# EAGLE design DACPSU (EAGLE 5.07)
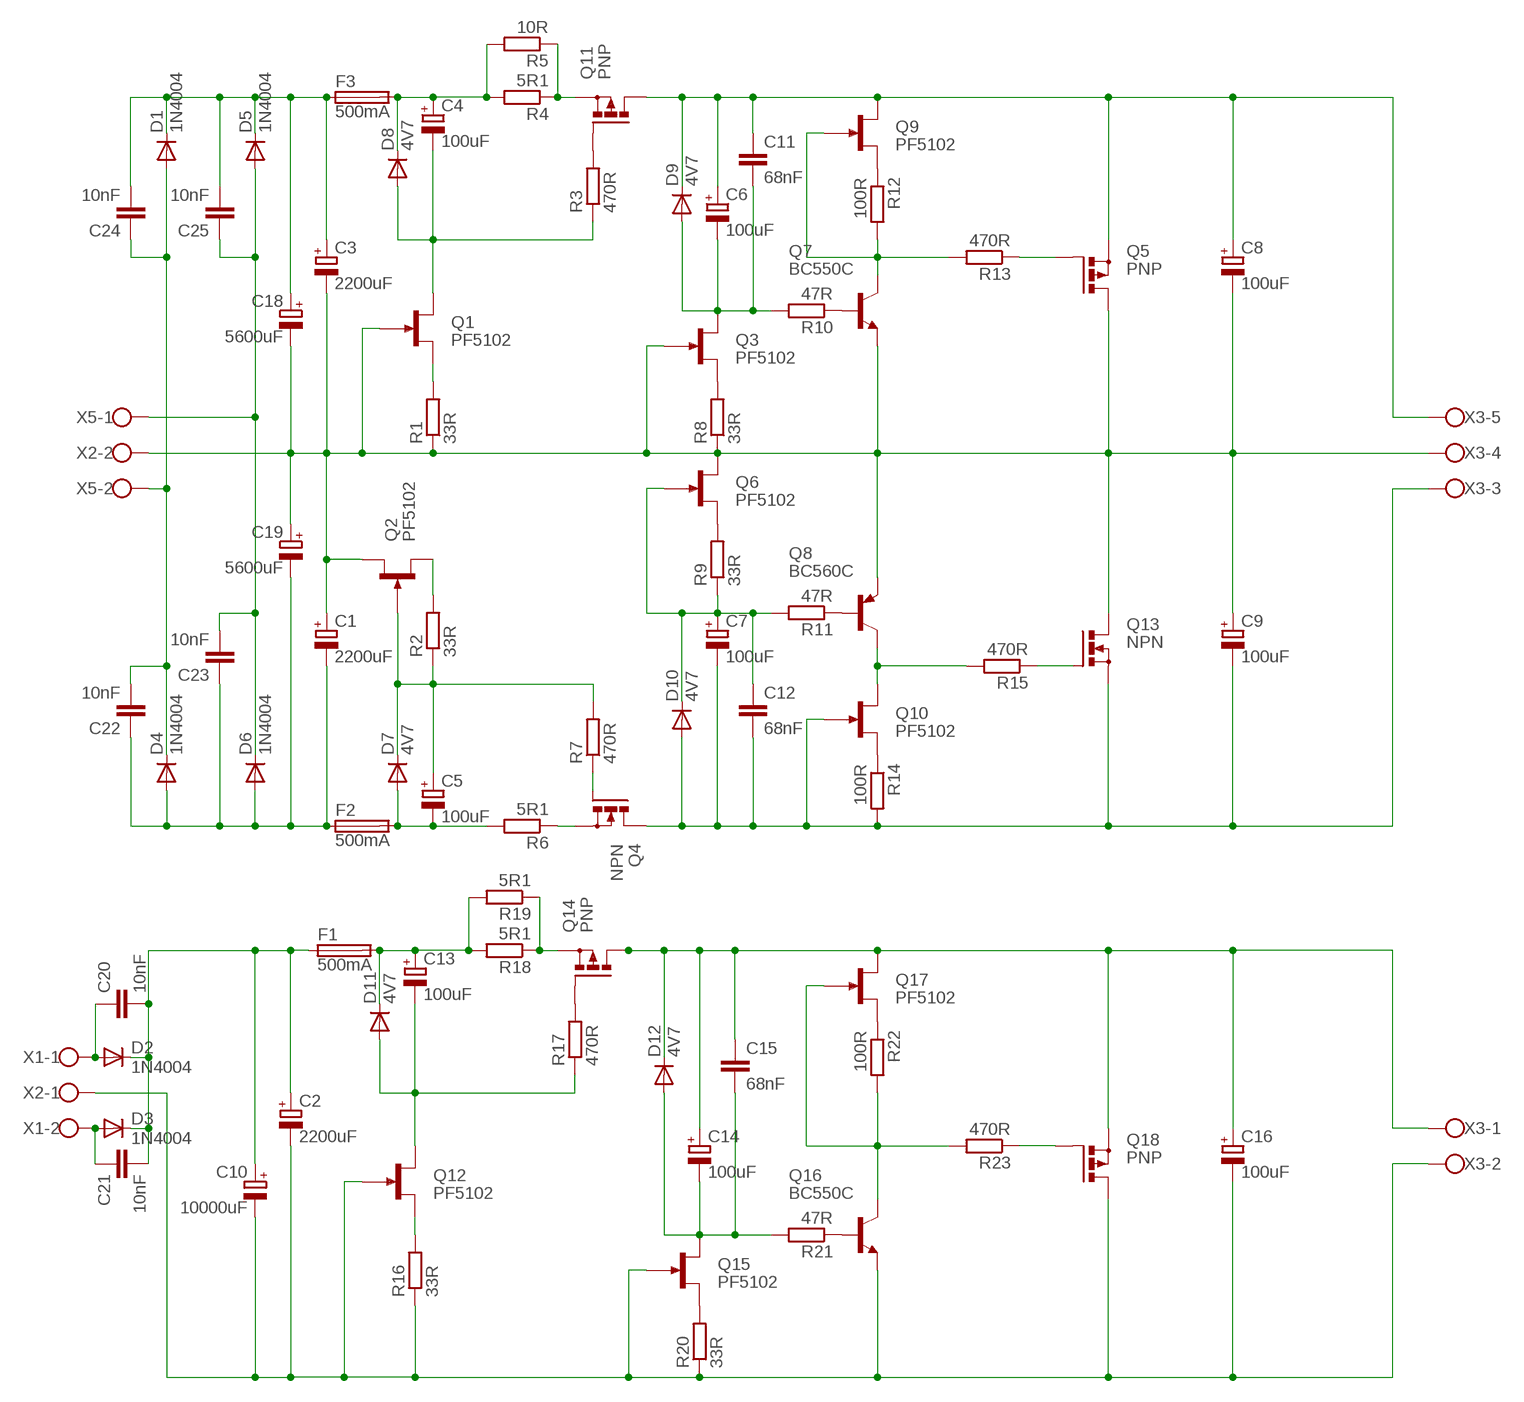
[diagram p0: schematic, sheet 1]

## Parts
C1  2200uF  CPOL-EUE7.5-18  [E7,5-18]
C2  2200uF  CPOL-EUE7.5-18  [E7,5-18]
C3  2200uF  CPOL-EUE7.5-18  [E7,5-18]
C4  100uF  CPOL-EUE3.5-8  [E3,5-8]
C5  100uF  CPOL-EUE3.5-8  [E3,5-8]
C6  100uF  CPOL-EUE3.5-8  [E3,5-8]
C7  100uF  CPOL-EUE3.5-8  [E3,5-8]
C8  100uF  CPOL-EUE7.5-18  [E7,5-18]
C9  100uF  CPOL-EUE7.5-18  [E7,5-18]
C10  10000uF  CPOL-EUE7.5-18  [E7,5-18]
C11  68nF  C-EU075-042X103  [C075-042X103]
C12  68nF  C-EU075-042X103  [C075-042X103]
C13  100uF  CPOL-EUE3.5-8  [E3,5-8]
C14  100uF  CPOL-EUE3.5-8  [E3,5-8]
C15  68nF  C-EU075-042X103  [C075-042X103]
C16  100uF  CPOL-EUE7.5-18  [E7,5-18]
C18  5600uF  CPOL-EUE7.5-18  [E7,5-18]
C19  5600uF  CPOL-EUE7.5-18  [E7,5-18]
C20  10nF  C-EU075-042X103  [C075-042X103]
C21  10nF  C-EU075-042X103  [C075-042X103]
C22  10nF  C-EU075-042X103  [C075-042X103]
C23  10nF  C-EU075-042X103  [C075-042X103]
C24  10nF  C-EU075-042X103  [C075-042X103]
C25  10nF  C-EU075-042X103  [C075-042X103]
D1  1N4004  [DO41-10]
D2  1N4004  [DO41-10]
D3  1N4004  [DO41-10]
D4  1N4004  [DO41-10]
D5  1N4004  [DO41-10]
D6  1N4004  [DO41-10]
D7  4V7  1N4004  [DO41-10]
D8  4V7  1N4004  [DO41-10]
D9  4V7  1N4004  [DO41-10]
D10  4V7  1N4004  [DO41-10]
D11  4V7  1N4004  [DO41-10]
D12  4V7  1N4004  [DO41-10]
F1  500mA  19560  [19560]
F2  500mA  19560  [19560]
F3  500mA  19560  [19560]
Q1  PF5102  2N5638  [TO92G]
Q2  PF5102  2N5638  [TO92G]
Q3  PF5102  2N5638  [TO92G]
Q4  NPN  PMOSFET_NTO220BH  [TO220BH]
Q5  PNP  PMOSFET_PTO220BH  [TO220BH]
Q6  PF5102  2N5638  [TO92G]
Q7  BC550C  BC550B  [TO92-EBC]
Q8  BC560C  BC560  [TO92-EBC]
Q9  PF5102  2N5638  [TO92G]
Q10  PF5102  2N5638  [TO92G]
Q11  PNP  PMOSFET_PTO220BH  [TO220BH]
Q12  PF5102  2N5638  [TO92G]
Q13  NPN  PMOSFET_NTO220BH  [TO220BH]
Q14  PNP  PMOSFET_PTO220BH  [TO220BH]
Q15  PF5102  2N5638  [TO92G]
Q16  BC550C  BC550B  [TO92-EBC]
Q17  PF5102  2N5638  [TO92G]
Q18  PNP  PMOSFET_PTO220BH  [TO220BH]
R1  33R  R-EU_0204/7  [0204/7]
R2  33R  R-EU_0204/7  [0204/7]
R3  470R  R-EU_0204/7  [0204/7]
R4  5R1  R-EU_0309/12  [0309/12]
R5  10R  R-EU_0309/12  [0309/12]
R6  5R1  R-EU_0309/12  [0309/12]
R7  470R  R-EU_0204/7  [0204/7]
R8  33R  R-EU_0204/7  [0204/7]
R9  33R  R-EU_0204/7  [0204/7]
R10  47R  R-EU_0204/7  [0204/7]
R11  47R  R-EU_0204/7  [0204/7]
R12  100R  R-EU_0204/7  [0204/7]
R13  470R  R-EU_0204/7  [0204/7]
R14  100R  R-EU_0204/7  [0204/7]
R15  470R  R-EU_0204/7  [0204/7]
R16  33R  R-EU_0204/7  [0204/7]
R17  470R  R-EU_0204/7  [0204/7]
R18  5R1  R-EU_0309/12  [0309/12]
R19  5R1  R-EU_0309/12  [0309/12]
R20  33R  R-EU_0204/7  [0204/7]
R21  47R  R-EU_0204/7  [0204/7]
R22  100R  R-EU_0204/7  [0204/7]
R23  470R  R-EU_0204/7  [0204/7]
X1  W237-02P  [W237-132]
X2  W237-02P  [W237-132]
X3  W237-05P  [W237-5P]
X5  W237-02P  [W237-132]

## Nets
N$1: C20.1 D2.A X1.1
N$2: C2.- C10.- C16.- Q12.G Q15.G Q16.E Q18.D R16.1 R20.1 X2.1 X3.2
N$3: C21.1 D3.A X1.2
N$4: Q15.S R20.2
N$5: Q16.B R21.1
N$6: C22.2 C24.1 D1.A D4.C X5.2
N$7: C23.2 C25.1 D5.A D6.C X5.1
N$8: C3.+ C18.+ C24.2 C25.2 D1.C D5.C F3.1
N$9: C4.+ D8.C F3.2 R4.2 R5.2
N$10: C5.- D7.A F2.2 R6.2
N$11: C4.- D8.A Q1.D R3.1
N$12: Q1.S R1.2
N$13: Q11.G R3.2
N$14: C5.+ D7.C Q2.G R2.1 R7.2
N$15: Q11.S R4.1 R5.1
N$16: Q2.S R2.2
N$17: Q4.G R7.1
N$18: Q4.S R6.1
N$19: C2.+ C10.+ C20.2 C21.2 D2.C D3.C F1.1
N$20: C7.- C9.- C12.2 D10.A Q4.D Q10.G Q13.S R14.2 X3.3
N$21: Q3.S R8.2
N$22: C6.- C11.2 D9.A Q3.D R10.2
N$23: Q6.S R9.2
N$24: C7.+ C12.1 D10.C Q6.G R9.1 R11.2
N$25: Q7.B R10.1
N$26: Q8.B R11.1
N$27: Q9.S R12.1
N$28: Q10.S R14.1
N$29: Q7.C Q9.G R12.2 R13.2
N$30: Q8.C Q10.D R15.2
N$31: Q5.G R13.1
N$32: Q13.G R15.1
N$33: C6.+ C8.+ C11.1 D9.C Q5.S Q9.D Q11.D X3.5
N$34: C13.- D11.A Q12.D R17.1
N$35: Q12.S R16.2
N$36: Q14.S R18.1 R19.1
N$37: Q14.G R17.2
N$38: C14.- C15.2 D12.A Q15.D R21.2
N$39: Q18.G R23.1
N$40: Q17.S R22.1
N$41: Q16.C Q17.G R22.2 R23.2
N$42: C14.+ C15.1 C16.+ D12.C Q14.D Q17.D Q18.S X3.1
N$43: C1.- C19.- C22.1 C23.1 D4.A D6.A F2.1
N$44: C1.+ C3.- C8.- C9.+ C18.- C19.+ Q1.G Q2.D Q3.G Q5.D Q6.D Q7.E Q8.E Q13.D R1.1 R8.1 X2.2 X3.4
N$45: C13.+ D11.C F1.2 R18.2 R19.2

## Library data of the parts
C1-C10 C13 C14 C16 C18 C19 = resistor:CPOL-EU: POLARIZED CAPACITOR, European symbol
C11 C12 C15 C20-C25 = resistor:C-EU: CAPACITOR, European symbol
D1-D12 = diode:1N4004: DIODE general purpose rectifier, 1 A
F1-F3 = fuse:19560: FUSE HOLDER TR5, Wickmann
Q1-Q3 Q6 Q9 Q10 Q12 Q15 Q17 = transistor-small-signal:2N5638: N-CHANNEL FET
Q4 Q13 = transistor-power:PMOSFET_N: Power MOSFET N-Channel
Q5 Q11 Q14 Q18 = transistor-power:PMOSFET_P: Power MOSFET P-Channel
Q7 Q16 = transistor-npn:BC550*: NPN Transistor
Q8 = transistor-pnp:BC560*: PNP Transistror
R1-R23 = resistor:R-EU_: RESISTOR, European symbol
X1 X2 X5 = con-wago-508:W237-02P: WAGO SREW CLAMP
X3 = con-wago-508:W237-05P: WAGO SREW CLAMP

## Board
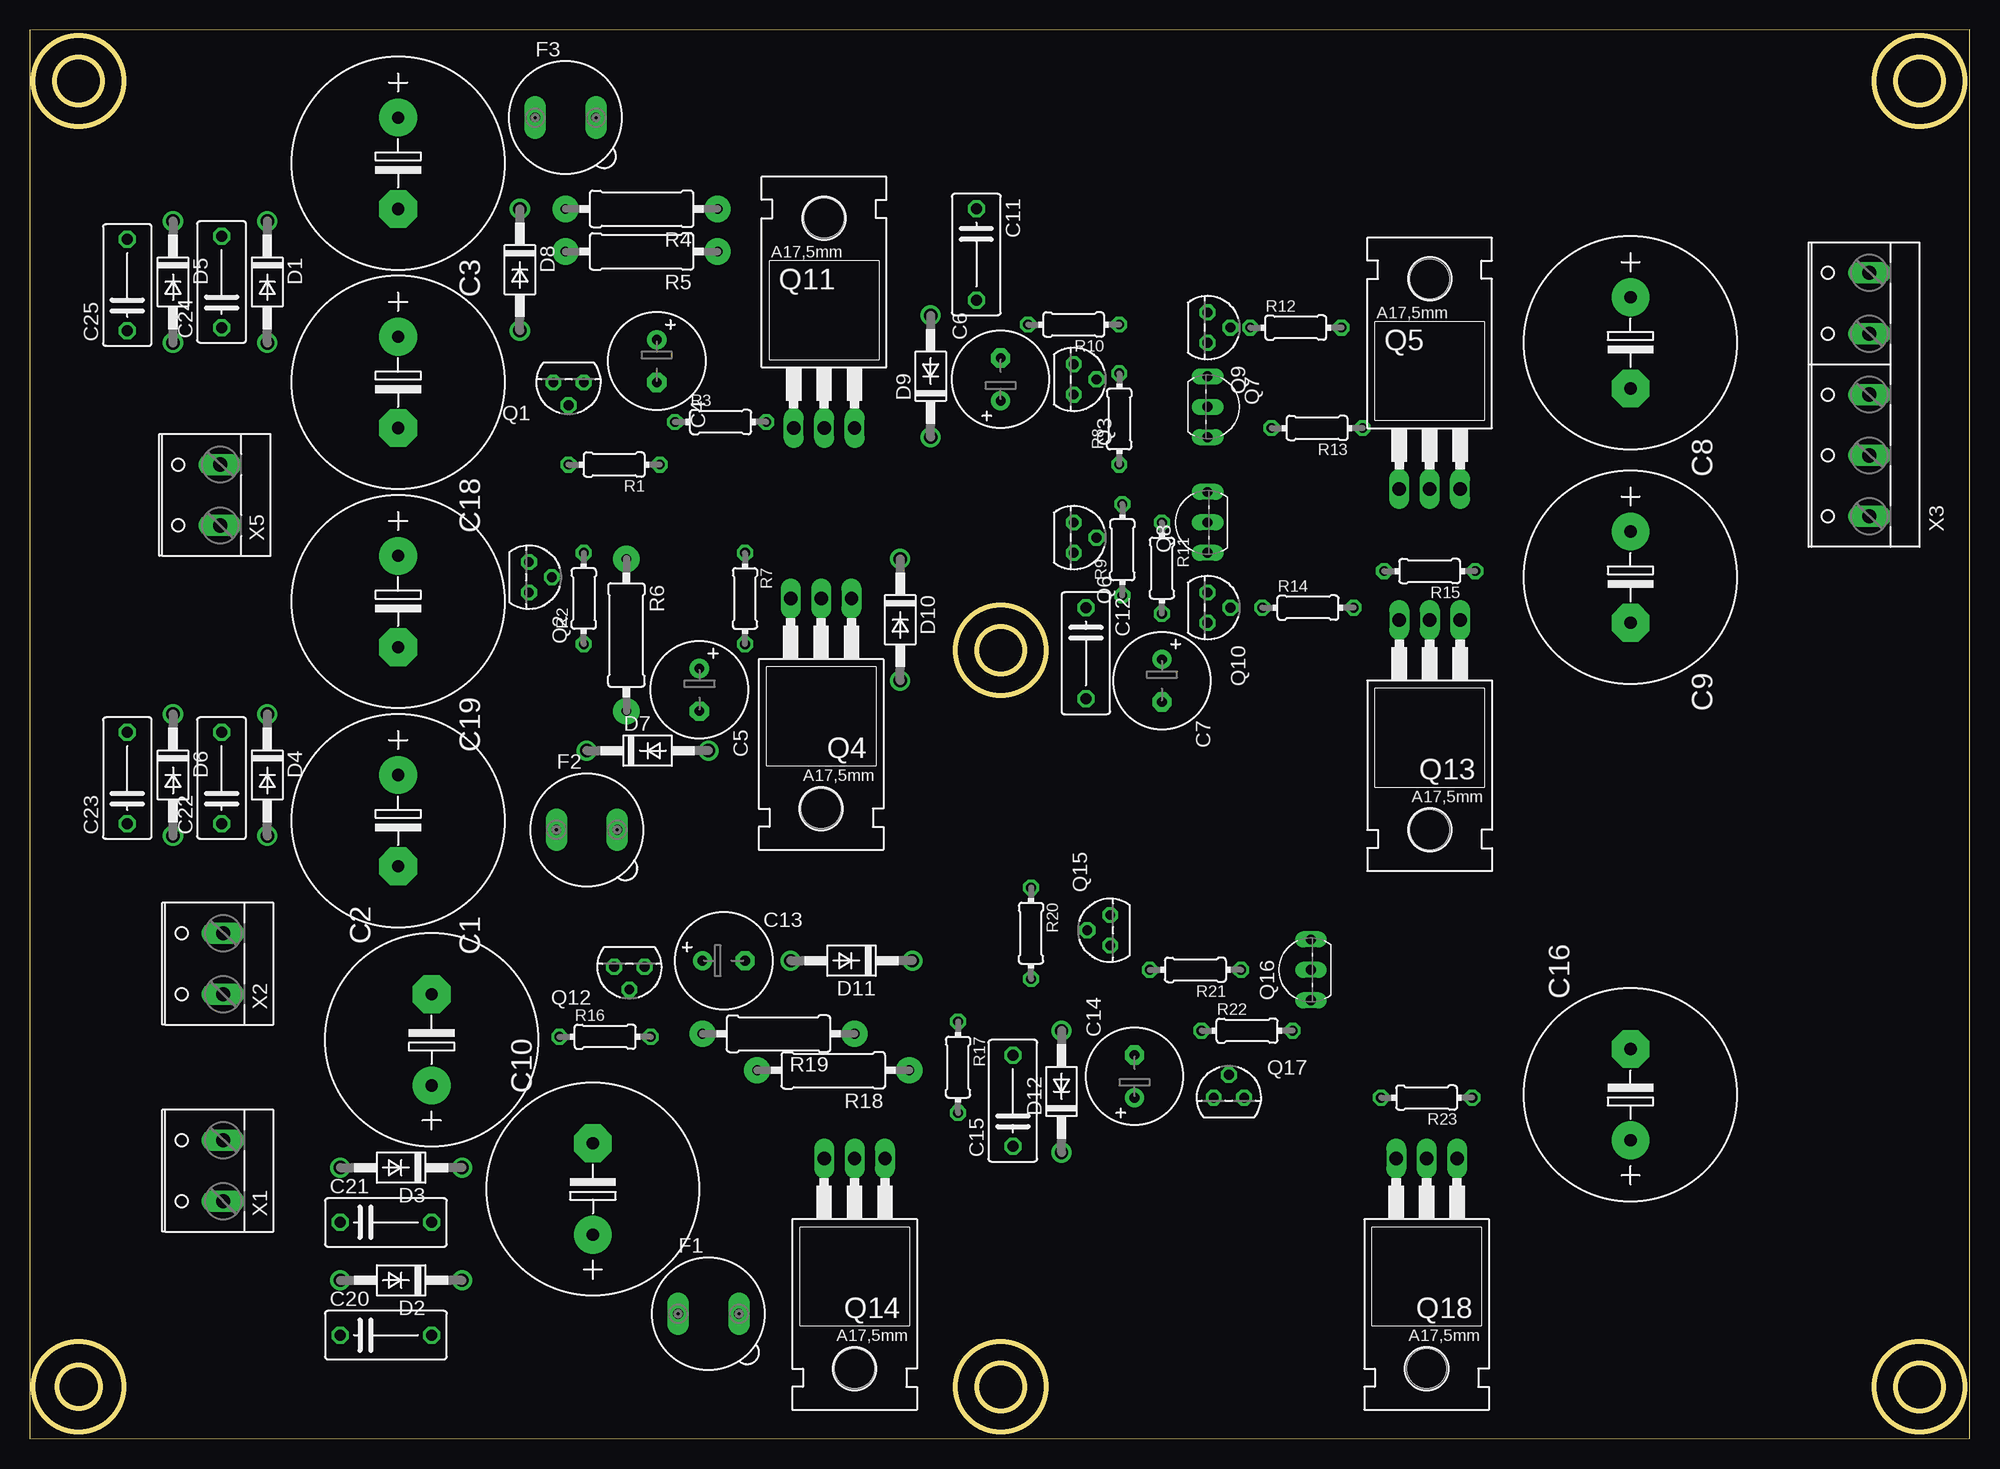
[diagram p1: board, top side]
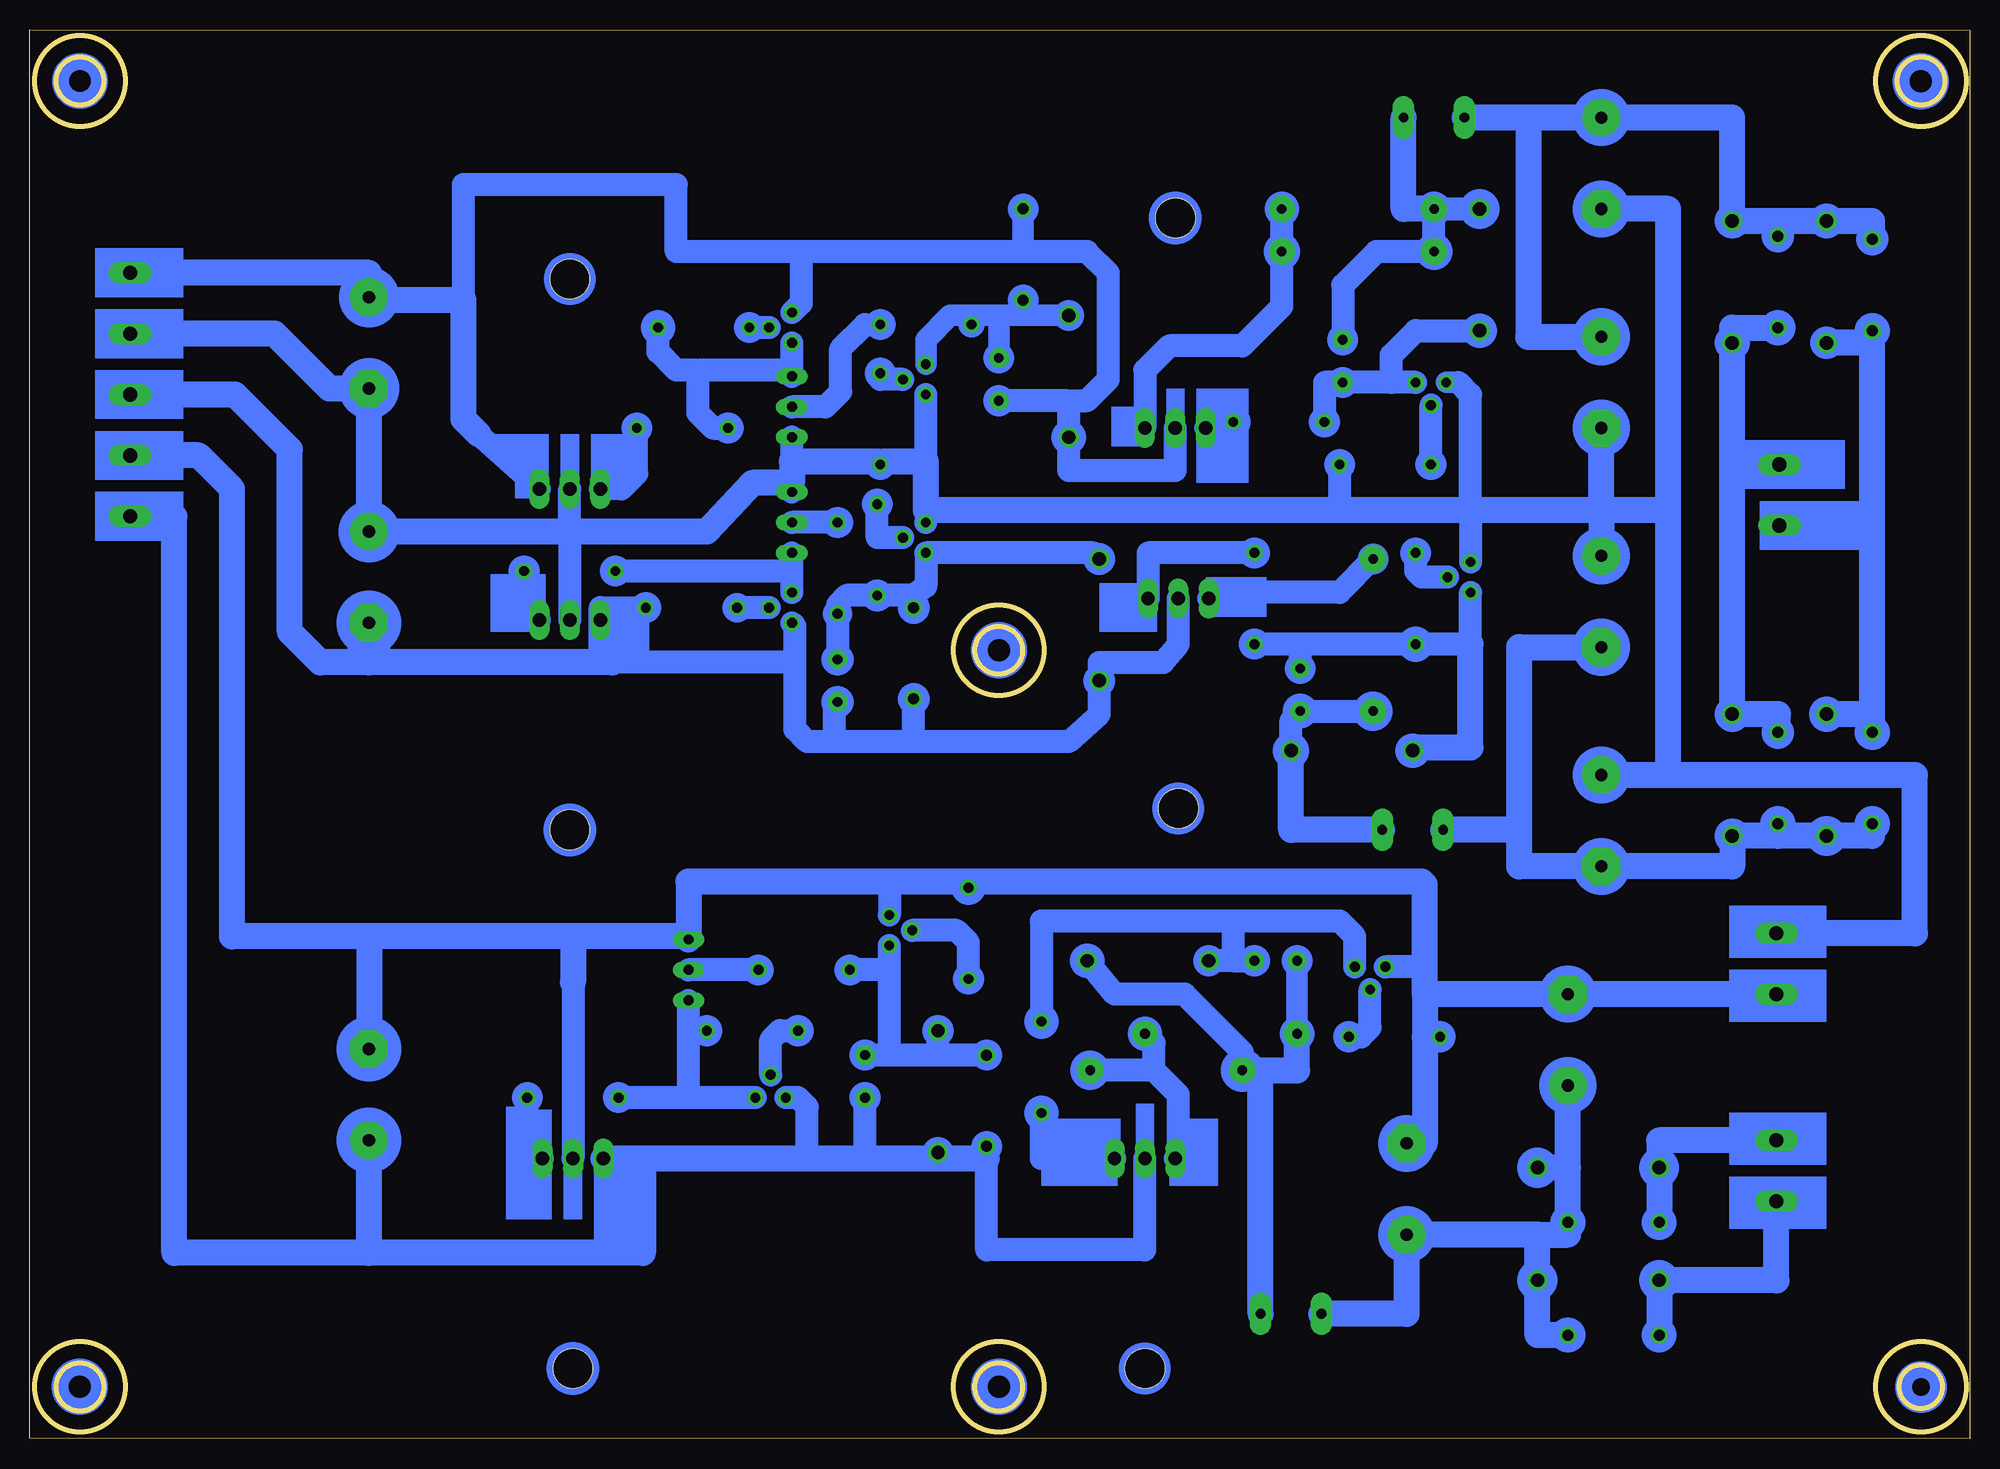
[diagram p2: board, bottom side, seen from below]

Size 161.91 x 117.55 mm. Coordinates in mm from the lower left corner, seen from the top.
Outline: 0,0 161.91,0.03 161.91,117.55 0,117.53 0,0
Outline: circle at 4.06,113.28 radius 3.78
Outline: circle at 157.73,113.28 radius 3.78
Outline: circle at 4.06,4.32 radius 3.78
Outline: circle at 157.73,4.32 radius 3.78
Outline: circle at 157.73,4.32 radius 1.98
Outline: circle at 4.06,113.28 radius 1.98
Outline: circle at 157.73,113.28 radius 1.98
Outline: circle at 4.06,4.32 radius 1.8
Outline: circle at 81.03,4.32 radius 3.78
Outline: circle at 81.03,4.32 radius 1.98
Outline: circle at 81.03,65.79 radius 3.78
Outline: circle at 81.03,65.79 radius 1.98
Copper layers (1*16): Top 0.035mm / dielectric 1.5mm / Bottom 0.035mm
Design rules "default": minimum track width 10mil, minimum drill 24mil, track to track 8mil, track to pad 8mil, pad to pad 8mil, via to via 8mil, smd to smd 8mil, copper to edge 40mil, drill to drill 8mil, minimum pad ring 10mil, minimum via ring 8mil, stop-mask expansion 4mil, vias tented up to drill 0mil, thermal gap 10mil

### Footprints (pad centres in the part's own frame; a part is rotated, then mirrored left to right if it is on the bottom)
E7,5-18 = drill 1.016 pad 3.15 round: + -3.81,0 | drill 1.016 pad 3.15 octagon: - 3.81,0
E3,5-8 = drill 0.813 pad 1.6 round: + -1.778,0 | drill 0.813 pad 1.6 octagon: - 1.778,0
C075-042X103 = drill 0.914 octagon: 1 -3.81,0; 2 3.81,0
DO41-10 = drill 1.118 round: A 5.08,0; C -5.08,0
19560 = drill 0.813 pad 1.778 long: 1 -2.54,0; 2 2.54,0
TO92G = drill 0.813 octagon: D -1.27,0; G 1.27,0; S 0,1.905
TO220BH = drill 1.118 long: D 0,-6.35; G -2.54,-6.35; S 2.54,-6.35 | hole 3.302: 0,11.176
TO92-EBC = drill 0.813 long: B 0,-1.27; C -2.54,-1.27; E 2.54,-1.27
0204/7 = drill 0.813 octagon: 1 -3.81,0; 2 3.81,0
0309/12 = drill 0.8 pad 2.184 round: 1 -6.35,0; 2 6.35,0
W237-132 = drill 1.194 long: 1 -2.54,-0.635; 2 2.54,-0.635
W237-5P = drill 1.194 long: 1 -10.16,-0.635; 2 -5.08,-0.635; 3 0,-0.635; 4 5.08,-0.635; 5 10.16,-0.635

### Placement (x,y rotation side)
C1  30.73,51.56 270 top
C2  33.53,33.27 90 top
C3  30.73,106.43 270 top
C4  52.32,89.92 270 top
C5  55.88,62.48 270 top
C6  81.03,88.39 90 top
C7  94.49,63.25 270 top
C8  133.6,91.44 270 top
C9  133.6,71.88 270 top
C10  46.99,20.83 90 top
C11  78.99,98.81 270 top
C12  88.14,65.53 270 top
C13  57.91,39.88 0 top
C14  92.2,30.23 90 top
C15  82.04,28.19 90 top
C16  133.6,28.7 90 top
C18  30.73,88.14 270 top
C19  30.73,69.85 270 top
C20  29.72,8.64 0 top
C21  29.72,18.03 0 top
C22  16,55.12 90 top
C23  8.13,55.12 90 top
C24  16,96.52 90 top
C25  8.13,96.27 90 top
D1  19.81,96.52 270 top
D2  30.99,13.21 180 top
D3  30.99,22.61 180 top
D4  19.81,55.37 270 top
D5  11.94,96.52 270 top
D6  11.94,55.37 270 top
D7  51.56,57.4 0 top
D8  40.89,97.54 270 top
D9  75.18,88.65 90 top
D10  72.64,68.33 270 top
D11  68.58,39.88 180 top
D12  86.11,28.96 90 top
F1  56.64,10.41 0 top
F2  46.48,50.8 0 top
F3  44.7,110.24 0 top
Q1  44.96,88.14 180 top
Q2  41.66,71.88 270 top
Q3  87.12,88.39 270 top
Q4  66.04,63.75 180 top
Q5  116.84,85.6 0 top
Q6  87.12,75.18 270 top
Q7  99.57,86.11 270 top
Q8  97.03,76.45 90 top
Q9  98.3,92.71 270 top
Q10  98.3,69.34 270 top
Q11  66.29,90.68 0 top
Q12  50.04,39.37 180 top
Q13  116.84,61.98 180 top
Q14  68.83,17.02 180 top
Q15  90.17,42.42 90 top
Q16  105.66,39.12 90 top
Q17  100.08,28.45 0 top
Q18  116.59,17.02 180 top
R1  48.77,81.28 180 top
R2  46.23,70.1 90 top
R3  57.66,84.84 0 top
R4  51.05,102.62 180 top
R5  51.05,99.06 180 top
R6  49.78,67.06 270 top
R7  59.69,70.1 270 top
R8  90.93,85.09 90 top
R9  91.19,74.17 90 top
R10  87.12,92.96 180 top
R11  94.49,72.64 270 top
R12  105.66,92.71 0 top
R13  107.44,84.33 180 top
R14  106.68,69.34 0 top
R15  116.84,72.39 180 top
R16  48.01,33.53 0 top
R17  77.47,30.99 270 top
R18  67.06,30.73 180 top
R19  62.48,33.78 180 top
R20  83.57,42.16 270 top
R21  97.28,39.12 180 top
R22  101.6,34.04 0 top
R23  116.59,28.45 180 top
X1  15.49,22.35 90 top
X2  15.49,39.62 90 top
X3  152.91,87.12 90 top
X5  15.24,78.74 90 top

### Tracks (layer width: path | path; a pad name or v marks a point on that pad's centre or on a via)
N$1
  Bottom 2.184: X1.1 16.13,13.21 D2.A C20.1
N$2
  Bottom 1.778: 45.47,33.53 45.21,33.53
  Bottom 1.93: 45.21,33.53 R16.1 | 45.72,39.37 Q12.G | 83.06,46.48 R20.1 84.07,46.48 90.17,46.48 | 90.17,46.48 Q15.G | 116.59,38.1 Q18.D | 106.93,46.48 90.17,46.48
  Bottom 2.184: 45.47,39.12 45.47,46.23 45.72,46.48 106.93,46.48 Q16.E 107.19,41.91 116.59,41.91 | 45.47,39.12 45.72,39.37 | 45.47,37.08 45.47,33.53 45.47,24.64 C10.- | 45.47,37.08 45.47,39.12 | 133.6,41.91 C16.- | 116.59,41.91 116.59,38.1 | X2.1 C2.- 45.47,37.08 | 133.6,41.91 145.03,41.91 145.03,79.25 147.83,82.04 X3.2 | 116.59,41.91 133.6,41.91
N$3
  Bottom 2.184: X1.2 25.91,24.89 D3.A C21.1
N$4
  Bottom 1.93: Q15.S 84.58,42.42 83.57,41.4 R20.2
N$5
  Bottom 1.93: R21.1 Q16.B
N$6
  Bottom 2.184: 19.81,81.28 D1.A 19.81,92.71 C24.1 | 19.81,81.28 X5.2 | 19.81,81.28 D4.C 16,60.45 C22.2
N$7
  Bottom 2.184: 8.13,91.44 C25.1 | C23.2 8.13,60.45 | 8.13,60.45 D6.C | 8.13,91.44 D5.A | 8.13,60.45 8.13,76.2 | 8.13,76.2 X5.1 | 8.13,76.2 8.13,91.44
N$8
  Bottom 2.184: D5.C 16,101.6 | 16,101.6 D1.C 19.81,110.24 C3.+ 36.83,110.24 | D5.C 8.13,101.6 C25.2 | 16,101.6 C24.2 | D5.C 14.48,101.6 | C18.+ 36.83,91.95 36.83,110.24 | 36.83,110.24 F3.1
N$9
  Bottom 1.93: D8.C R4.2 R5.2 49.53,99.06 52.32,96.27 C4.+
  Bottom 2.184: F3.2 47.24,102.62 R4.2
N$10
  Bottom 1.93: D7.A 56.64,59.94 C5.- R6.2
  Bottom 2.184: F2.2 56.64,50.8 D7.A
N$11
  Bottom 1.93: R3.1 53.85,88.14 C4.- 48.26,88.14 | Q1.D 48.26,88.14 | D8.A 46.23,92.46 48.26,90.42 48.26,88.14
N$12
  Bottom 1.93: R1.2 Q1.S
N$13
  Bottom 1.93: R3.2 Q11.G
N$14
  Bottom 1.93: Q2.G 41.66,66.29 R2.1 55.88,66.29 | 55.88,66.29 R7.2 | 55.88,66.29 C5.+ | 46.23,57.66 D7.C
  Bottom 2.184: 46.23,57.66 41.66,57.66 41.66,66.29
N$15
  Bottom 1.93: R4.1 R5.1 57.4,94.49 60.71,91.19 66.8,91.19 68.83,89.15 Q11.S
N$16
  Bottom 1.93: Q2.S 45.72,71.88 46.23,72.39 R2.2
N$17
  Bottom 1.93: R7.1 68.58,73.91 Q4.G
N$18
  Bottom 1.93: R6.1 52.58,70.61 62.74,70.61 63.25,70.1 Q4.S
N$19
  Bottom 2.184: 36.07,17.02 33.53,17.02 C21.2 33.53,22.61 | 36.07,17.02 C10.+ 46.99,10.41 F1.1 | 33.53,22.61 C2.+ | 33.53,22.61 D3.C | 36.07,17.02 D2.C 36.07,8.64 C20.2
N$20
  Bottom 1.93: Q4.D 66.04,66.29 67.31,64.77 72.64,64.77 D10.A 72.64,60.45 75.18,58.17 88.14,58.17 | 98.04,64.77 113.28,64.77 114.3,64.77 Q13.S 114.3,69.34 R14.2 | Q10.G 98.04,67.82 98.04,64.77 | 88.14,58.17 94.74,58.17 | 94.74,58.17 97.03,58.17 98.04,59.18 98.04,64.77 | 88.14,58.17 C12.2 | C7.- 94.74,61.21 94.74,58.17
  Bottom 2.184: 133.6,64.77 C9.- | 113.28,64.77 133.6,64.77 | X3.3 144.78,87.12 140.21,82.55 140.21,67.31 137.67,64.77 133.6,64.77
N$21
  Bottom 1.93: Q3.S 90.93,88.39 R8.2
N$22
  Bottom 1.778: D9.A 78.99,93.73 | 78.99,93.73 81.03,93.73 | 81.03,93.73 83.31,93.73 | 83.31,93.73 85.09,93.73 87.12,91.69 Q3.D | 83.31,93.73 R10.2 | 81.03,93.73 C6.- | 78.99,93.73 C11.2
N$23
  Bottom 1.93: Q6.S 91.19,75.18 R9.2
N$24
  Bottom 1.778: 88.14,70.36 C12.1
  Bottom 1.93: D10.C 72.64,73.66 73.15,73.91 Q6.G 87.12,71.12 88.14,70.36 R9.1 93.73,70.36 94.49,69.6 R11.2 C7.+
N$25
  Bottom 1.93: R10.1 92.2,92.96 94.23,90.93 94.23,87.38 95.5,86.11 Q7.B
N$26
  Bottom 1.93: R11.1 Q8.B
N$27
  Bottom 1.93: Q9.S R12.1
N$28
  Bottom 1.93: Q10.S R14.1
N$29
  Bottom 1.93: Q7.C 98.3,89.15 | 98.3,89.15 Q9.G | R13.2 104.9,84.33 106.17,85.6 106.17,88.9 | 106.17,88.9 105.92,89.15 98.3,89.15 | 106.17,88.9 106.43,89.15 107.95,89.15 109.47,90.68 R12.2
N$30
  Bottom 1.93: Q10.D 98.3,72.39 | 98.3,72.39 Q8.C | 98.3,72.39 R15.2
N$31
  Bottom 1.93: Q5.G 112.52,79.25 111.25,80.52 R13.1
N$32
  Bottom 1.93: Q13.G 120.4,68.33 120.65,68.58 R15.1
N$33
  Bottom 1.778: 78.99,99.06 C11.1
  Bottom 1.93: 75.44,86.61 75.18,85.6 D9.C 75.18,80.77 66.29,80.77 Q11.D | 75.44,86.61 C6.+ | 75.44,86.61 73.66,86.61 71.88,88.39 71.88,97.28 73.66,99.06 78.99,99.06 97.54,99.06 | Q9.D 97.54,94.74 97.54,99.06 | 97.54,99.06 107.95,99.06 107.95,104.65 125.73,104.65 125.73,95 | 124.46,83.82 Q5.S
  Bottom 2.184: X3.5 133.6,97.28 C8.+ 133.6,95 125.73,95 125.73,85.09 124.46,83.82
N$34
  Bottom 1.93: 61.47,39.88 C13.- | 61.47,39.88 D11.A | 61.47,43.18 61.47,39.88 | 61.47,43.18 77.47,43.18 R17.1 | Q12.D 51.31,41.91 52.58,43.18 61.47,43.18
N$35
  Bottom 1.93: R16.2 50.8,33.53 50.04,34.29 Q12.S
N$36
  Bottom 1.93: R19.1 68.07,33.02 68.07,30.73 | Q14.S 66.04,23.62 66.04,28.7 68.07,30.73 | 68.07,30.73 R18.1
N$37
  Bottom 1.93: Q14.G 77.47,23.37 R17.2
N$38
  Bottom 1.93: 90.17,39.12 Q15.D | C15.2 86.11,32 | 86.11,32 90.17,32 | 90.17,32 C14.- | 90.17,39.12 R21.2 | 86.11,32 D12.A | 90.17,32 90.17,39.12
N$39
  Bottom 1.93: Q18.G 119.89,23.37 120.4,23.88 R23.1
N$40
  Bottom 1.93: Q17.S 100.08,33.27 99.31,34.04 R22.1
N$41
  Bottom 1.93: 106.93,34.04 R22.2 | 106.93,34.04 Q16.C | 106.93,28.45 R23.2 | 106.93,28.45 106.93,34.04 | Q17.G 106.93,28.45
N$42
  Bottom 1.93: Q14.D 68.83,15.75 82.04,15.75 82.04,23.37 C15.1 | D12.C 86.11,23.37 | 92.2,23.37 C14.+ | Q17.D 97.79,28.45 97.03,27.69 97.03,23.37
  Bottom 2.184: 82.04,23.37 86.36,23.37 | 86.36,23.37 92.2,23.37 97.03,23.37 110.74,23.37 | 110.74,23.37 Q18.S | D12.C 86.36,23.62 86.36,23.37 | 133.6,15.49 C16.+ | 133.6,15.49 110.74,15.49 110.74,23.37 | X3.1 149.86,76.96 149.86,15.49 133.6,15.49
N$43
  Bottom 2.184: 16,50.29 D6.A 8.13,50.29 C23.1 | 16,50.29 D4.A 19.81,47.75 C1.- | 16,50.29 C22.1 | C1.- 37.59,47.75 37.59,50.8 | C19.- 37.59,66.04 37.59,50.8 | C1.- 30.73,46.74 | 37.59,50.8 F2.1
N$44
  Bottom 1.778: 42.67,88.14 Q1.G
  Bottom 1.93: 87.12,81.28 87.12,81.53 Q3.G | 87.12,77.47 Q6.D | 98.3,79.76 Q8.E | Q13.D 116.84,75.69 Q5.D | 42.67,88.14 41.66,87.12 41.66,77.47 Q2.D | 98.3,81.53 Q7.E | 52.58,77.47 R1.1
  Bottom 2.184: 87.12,81.28 87.12,77.47 52.58,77.47 41.66,77.47 30.73,77.47 | 87.12,81.53 90.68,81.53 R8.1 91.19,81.53 98.3,81.53 98.3,79.76 101.6,79.76 105.41,75.69 116.84,75.69 124.21,75.69 C9.+ C8.- 136.91,87.63 141.48,92.2 144.53,92.2 X3.4 | C3.- 25.15,102.62 25.15,77.47 | 25.15,55.37 C1.+ | X2.2 4.57,42.16 4.57,55.37 25.15,55.37 | 25.15,55.37 25.15,77.47 | 25.15,77.47 30.73,77.47 | 30.73,77.47 C19.+ | 30.73,77.47 C18.-
N$45
  Bottom 1.778: R19.2 C13.+
  Bottom 1.93: D11.C 71.37,37.08 65.53,37.08 60.71,32.26 R18.2
  Bottom 2.184: R19.2 56.13,30.73 59.18,30.73 | 59.18,30.73 R18.2 | F1.2 59.18,30.73
(copper drawn outside any net)
  shapes: Bottom area x41, Bottom circle x138